# Altium project SpaceWallACPowerDistribution.PrjPcb (part 3 of 3)

## Sheet ACPowerDistributionFanControl.SchDoc
size B; SheetNumber: 5; SheetTotal: 5
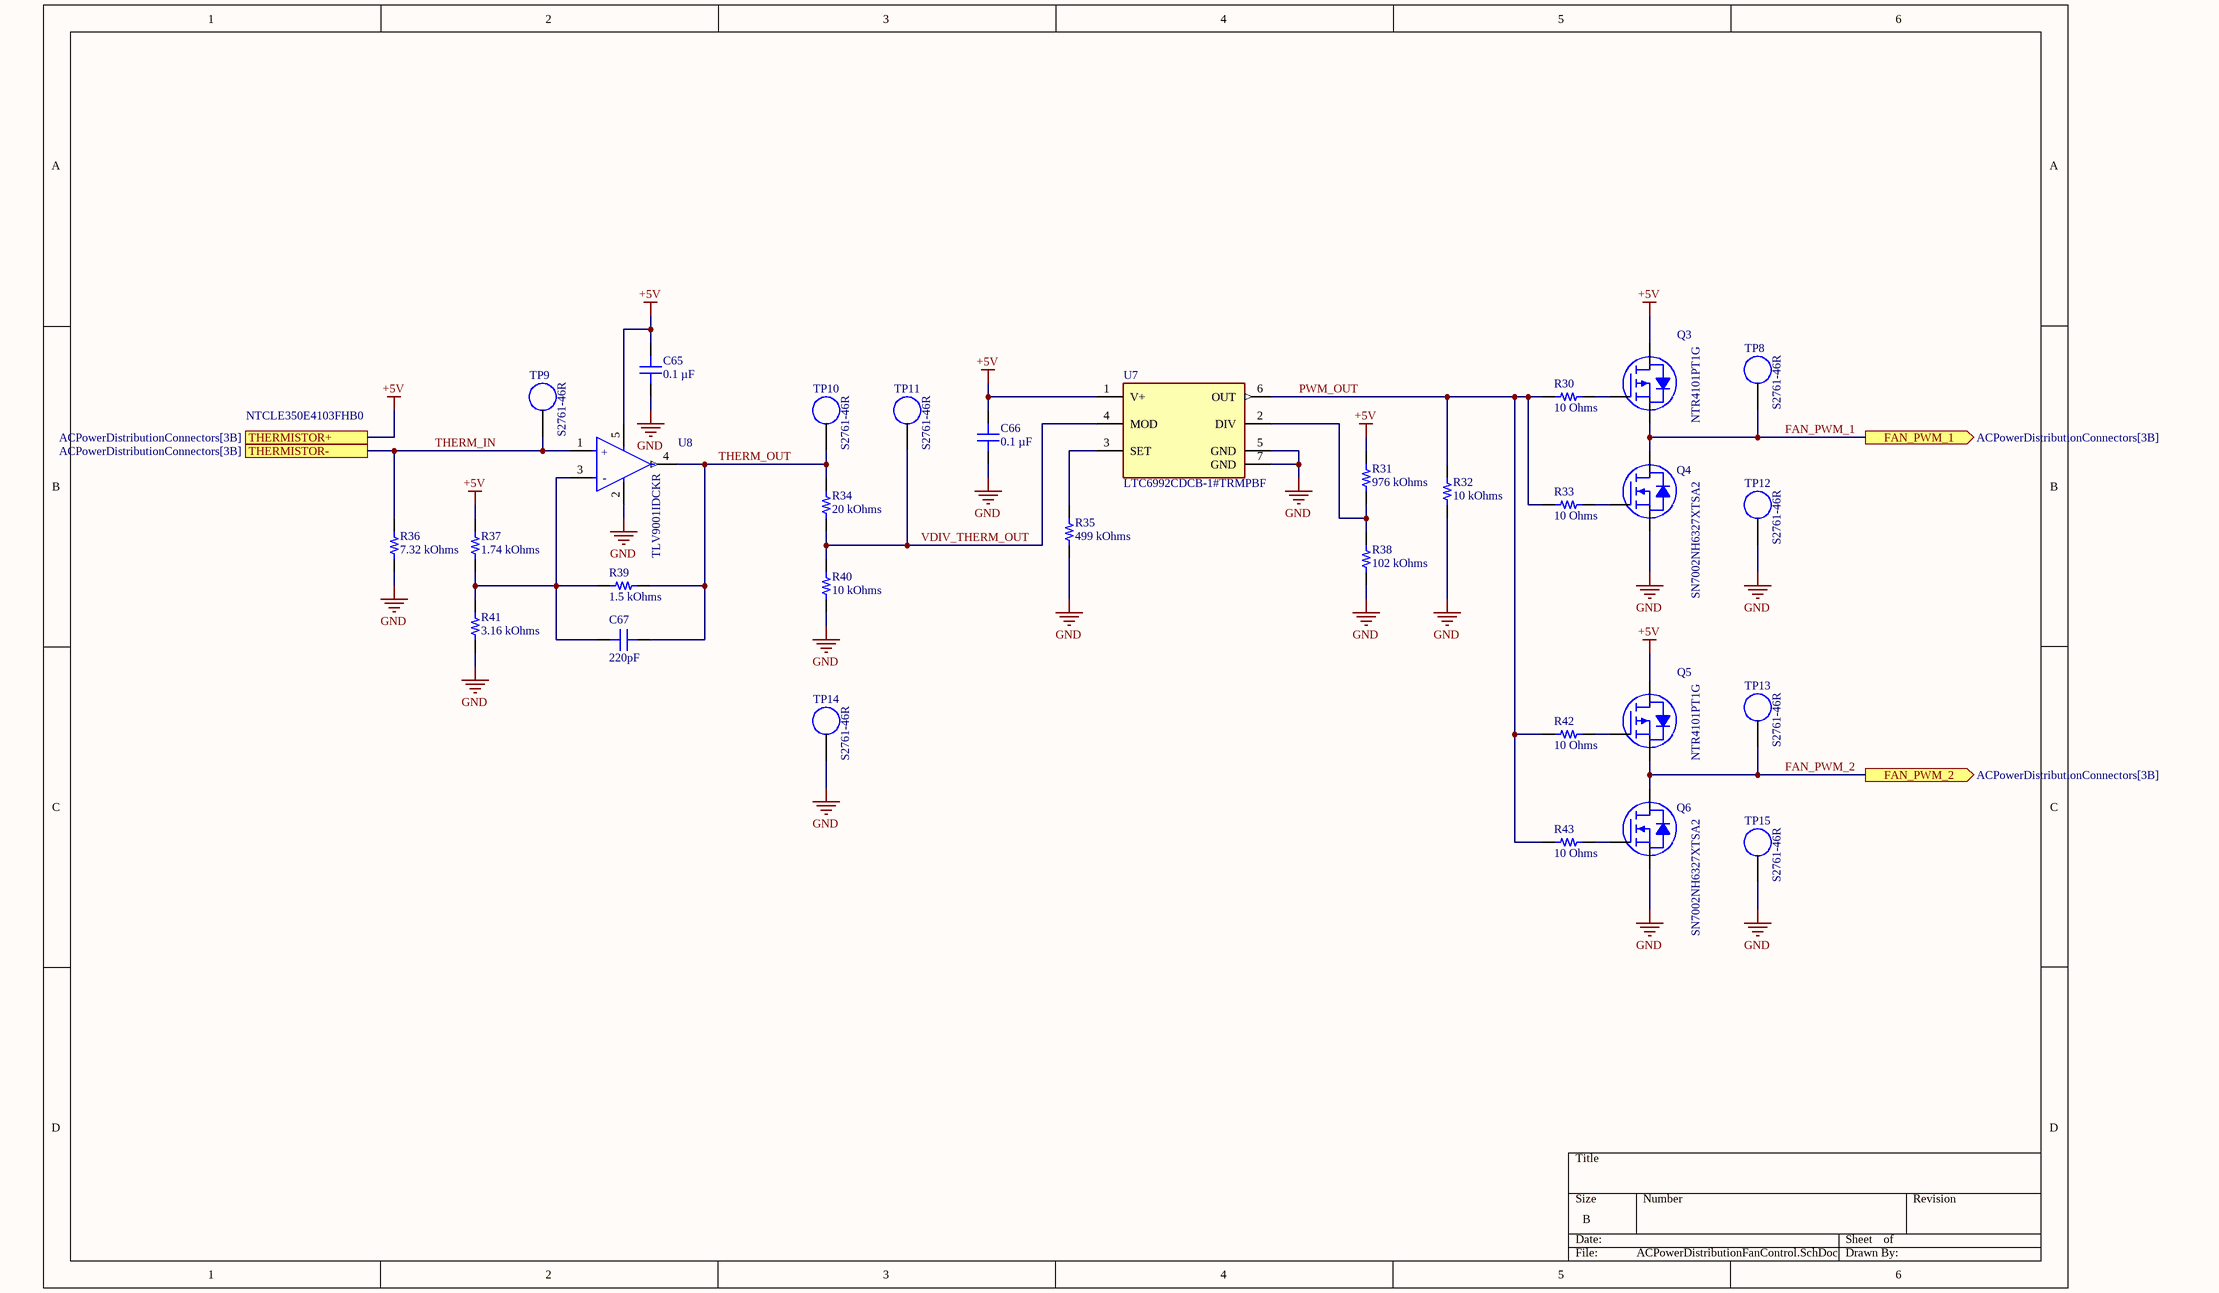
[diagram p4: ACPowerDistributionFanControl.SchDoc]

### Parts
C65  0.1 µF  [CAP 0603_1608]
C66  0.1 µF  [CAP 0603_1608]
C67  220pF  [CAP 0603_1608]
Q3  NTR4101PT1G  [ON SEMI SOT-23-3]
Q4  SN7002NH6327XTSA2  [INFINEON SOT-23-3]
Q5  NTR4101PT1G  [ON SEMI SOT-23-3]
Q6  SN7002NH6327XTSA2  [INFINEON SOT-23-3]
R30  10 Ohms  [RES 0603_1608]
R31  976 kOhms  [RES 0603_1608]
R32  10 kOhms  [RES 0603_1608]
R33  10 Ohms  [RES 0603_1608]
R34  20 kOhms  [RES 0603_1608]
R35  499 kOhms  [RES 0603_1608]
R36  7.32 kOhms  [RES 0603_1608]
R37  1.74 kOhms  [RES 0603_1608]
R38  102 kOhms  [RES 0603_1608]
R39  1.5 kOhms  [RES 0603_1608]
R40  10 kOhms  [RES 0603_1608]
R41  3.16 kOhms  [RES 0603_1608]
R42  10 Ohms  [RES 0603_1608]
R43  10 Ohms  [RES 0603_1608]
TP8  S2761-46R  [S2761-46R]
TP9  S2761-46R  [S2761-46R]
TP10  S2761-46R  [S2761-46R]
TP11  S2761-46R  [S2761-46R]
TP12  S2761-46R  [S2761-46R]
TP13  S2761-46R  [S2761-46R]
TP14  S2761-46R  [S2761-46R]
TP15  S2761-46R  [S2761-46R]
U7  LTC6992CDCB-1#TRMPBF  [FP-DCB-6-05-08-1715-MFG]
U8  TLV9001IDCKR  [FP-DCK0005A-MFG]

### Ports
FAN_PWM_1 (out, see ACPowerDistributionConnectors[3B]), FAN_PWM_2 (out, see ACPowerDistributionConnectors[3B]), THERMISTOR+ (see ACPowerDistributionConnectors[3B]), THERMISTOR- (see ACPowerDistributionConnectors[3B])

### Nets
+5V: C65.2 C66.2 Q3.3(D) Q5.3(D) R31.2 R37.2 U7.1(V+) U8.5(V+) ; port THERMISTOR+
GND: C65.1 C66.1 Q4.2(S) Q6.2(S) R32.1 R35.1 R36.1 R38.1 R40.1 R41.1 TP12.1 TP14.1 TP15.1 U7.5(GND) U7.7(GND) U8.2(V-)
FAN_PWM_1: Q3.2(S) Q4.3(D) TP8.1 ; port FAN_PWM_1
FAN_PWM_2: Q5.2(S) Q6.3(D) TP13.1 ; port FAN_PWM_2
PWM_OUT: R30.1 R32.2 R33.1 R42.1 R43.1 U7.6(OUT)
THERM_IN: R36.2 TP9.1 U8.1(IN+) ; port THERMISTOR-
THERM_OUT: C67.2 R34.2 R39.2 TP10.1 U8.4(OUT)
VDIV_THERM_OUT: R34.1 R40.2 TP11.1 U7.4(MOD)
NetC67_1: C67.1 R37.1 R39.1 R41.2 U8.3(IN-)
NetQ3_1: Q3.1(G) R30.2
NetQ4_1: Q4.1(G) R33.2
NetQ5_1: Q5.1(G) R42.2
NetQ6_1: Q6.1(G) R43.2
NetR31_1: R31.1 R38.2 U7.2(DIV)
NetR35_2: R35.2 U7.3(SET)

### Notes on the sheet
- NTCLE350E4103FHB0
- (in symbol CMP-04895-000186-1) +; -

### Library data of the parts
C65 C66 = CL10B104KA8WPNC: CAP CER 0.1UF 25V X7R 0603; manufacturer: Samsung Electro-Mechanics; Tolerance: ±10%; Part Number: CL10B104KA8WPNC; Capacitance: 0.1 µF; Applications: Automotive; componentlink1description: Datasheet; componentlink1url: http://www.samsungsem.com/kr/support/product-search/mlcc/CL10B104KA8WPNC.jsp; componentlink2description: DigiKey Link; componentlink2url: https://www.digikey.com/en/products/detail/samsung-electro-mechanics/CL10B104KA8WPNC/5961201; Device Package: 0603 (1608 Metric); Features: Open Mode; lastupdated: 2/9/2024 8:10:26 PM; Lifecycle Status: Active; Minimum Order: 1; Mounting Type: Surface Mount, MLCC; Operating Temperature: -55°C ~ 125°C; Package / Case: 0603 (1608 Metric); packaging: TapeAndReel; partid: 5631; Part Status: Active; price: 0.01; Ratings: AEC-Q200; series: CL; Size / Dimension: 0.063" L x 0.031" W (1.60mm x 0.80mm); Supplier 1: DigiKey; Supplier Part Number 1: 1276-6717-1-ND; Temperature Coefficient: X7R; Thickness (Max): 0.035" (0.90mm); value: 0.1 µF; Voltage - Rated: 25V
C67 = 06033A221KAT2A: CAP CER 220PF 25V C0G/NP0 0603; manufacturer: AVX Corporation; Temperature Coefficient: C0G, NP0; Tolerance: ±10%; Part Number: 06033A221KAT2A; Capacitance: 220pF; Applications: General Purpose; componentlink1description: Datasheet; componentlink1url: http://datasheets.avx.com/C0GNP0-Dielectric.pdf; componentlink2description: DigiKey Link; componentlink2url: http://digikey.com/product-detail/en/avx-corporation/06033A221KAT2A/478-06033A221KAT2ACT-ND/11570165; Device Package: 0603 (1608 Metric); lastupdated: 9/2/2020 1:02:55 AM; Lifecycle Status: Active; Minimum Order: 1; Mounting Type: Surface Mount, MLCC; Operating Temperature: -55°C ~ 125°C; Package / Case: 0603 (1608 Metric); packaging: TapeAndReel; partid: 27402; Part Status: Active; price: 0.04; series: -; Supplier 1: DigiKey; Supplier Part Number 1: 478-06033A221KAT2ACT-ND; value: 220pF; Voltage - Rated: 25V
Q3 Q5 = NTR4101PT1G: MOSFET P-CH 20V 1.8A SOT-23; Manufacturer: ON Semiconductor; Current - Continuous Drain (Id) @ 25°C: 1.8A (Ta); Drive Voltage (Max Rds On,  Min Rds On): 1.8V, 4.5V; FET Type: P-Channel; Gate Charge (Qg) (Max) @ Vgs: 8.5nC @ 4.5V; Input Capacitance (Ciss) (Max) @ Vds: 675pF @ 10V; Power Dissipation (Max): 420mW (Ta); Rds On (Max) @ Id, Vgs: 85mOhm @ 1.6A, 4.5V; Vgs (Max): ±8V; Vgs(th) (Max) @ Id: 1.2V @ 250µA; Part Number: NTR4101PT1G; ComponentLink1Description: Datasheet; ComponentLink1URL: http://www.onsemi.com/pub/Collateral/NTR4101P-D.PDF; ComponentLink2Description: DigiKey Link; ComponentLink2URL: http://digikey.com/product-detail/en/on-semiconductor/NTR4101PT1G/NTR4101PT1GOSCT-ND/687132; Drain to Source Voltage (Vdss): 20V; LastUpdated: 6/3/2024 8:15:27 PM; Lifecycle Status: Active; Minimum Order: 1; Mounting Type: Surface Mount; Operating Temperature: -55°C ~ 150°C (TJ); Package / Case: TO-236-3, SC-59, SOT-23-3; Packaging: TapeAndReel; Part Status: Active; Price: 0.07; Series: -; Supplier 1: DigiKey; Supplier Part Number 1: NTR4101PT1GOSCT-ND; Supplier Device Package: SOT-23-3 (TO-236); Technology: MOSFET (Metal Oxide)
Q4 Q6 = SN7002NH6327XTSA2: MOSFET N-CH 60V 200MA SOT23-3; Manufacturer: Infineon Technologies; Current - Continuous Drain (Id) @ 25°C: 200mA (Ta); Drive Voltage (Max Rds On,  Min Rds On): 4.5V, 10V; FET Type: N-Channel; Gate Charge (Qg) (Max) @ Vgs: 1.5 nC @ 10 V; Input Capacitance (Ciss) (Max) @ Vds: 45 pF @ 25 V; Power Dissipation (Max): 360mW (Ta); Rds On (Max) @ Id, Vgs: 5Ohm @ 500mA, 10V; Vgs (Max): ±20V; Vgs(th) (Max) @ Id: 1.8V @ 26µA; Part Number: SN7002NH6327XTSA2; ComponentLink1Description: Datasheet; ComponentLink1URL: https://www.infineon.com/dgdl/SN7002N_Rev2.6_.pdf?folderId=db3a3043156fd573011622e10b5c1f67&fileId=db3a304330f6860601311934e76045d5; ComponentLink2Description: DigiKey Link; ComponentLink2URL: https://www.digikey.com/en/products/detail/infineon-technologies/SN7002NH6327XTSA2/6164410; Drain to Source Voltage (Vdss): 60 V; LastUpdated: 6/3/2024 8:15:23 PM; Lifecycle Status: Active; Minimum Order: 1; Mounting Type: Surface Mount; Operating Temperature: -55°C ~ 150°C (TJ); Package / Case: TO-236-3, SC-59, SOT-23-3; Packaging: TapeAndReel; Part Status: Active; Price: 0.04; Series: SIPMOS®; Supplier 1: DigiKey; Supplier Part Number 1: SN7002NH6327XTSA2CT-ND; Supplier Device Package: PG-SOT23; Technology: MOSFET (Metal Oxide)
R30 R33 R42 R43 = RMCF0603FT10R0: RES 10 OHM 1% 1/10W 0603; Manufacturer: Stackpole Electronics Inc; Power (Watts): 0.1W, 1/10W; Temperature Coefficient: ±100ppm/°C; Part Number: RMCF0603FT10R0; Value: 10 Ohms; ComponentLink1Description: Datasheet; ComponentLink1URL: https://www.seielect.com/catalog/sei-rmcf_rmcp.pdf; ComponentLink2Description: DigiKey Link; ComponentLink2URL: https://www.digikey.com/en/products/detail/stackpole-electronics-inc/RMCF0603FT10R0/1761152; Composition: Thick Film; Device Package: 0603 (1608 Metric); Features: Automotive AEC-Q200; Height - Seated (Max): 0.022" (0.55mm); LastUpdated: 2/9/2024 8:43:32 PM; Lifecycle Status: Active; Minimum Order: 1; Number of Terminations: 2; Operating Temperature: -55°C ~ 155°C; Package / Case: 0603 (1608 Metric); Packaging: CutTape; PartId: 6083; Part Status: Active; Price: 0.01; Ratings: AEC-Q200; Resistance: 10 Ohms; Series: RMCF; Size / Dimension: 0.061" L x 0.031" W (1.55mm x 0.80mm); Supplier 1: DigiKey; Supplier Part Number 1: RMCF0603FT10R0CT-ND; Supplier Device Package: 0603; Tolerance: ±1%
R31 = RMCF0603FT976K: RES 976K OHM 1% 1/10W 0603; Manufacturer: Stackpole Electronics Inc; Power (Watts): 0.1W, 1/10W; Temperature Coefficient: ±100ppm/°C; Part Number: RMCF0603FT976K; Value: 976 kOhms; ComponentLink1Description: Datasheet; ComponentLink1URL: https://www.seielect.com/catalog/sei-rmcf_rmcp.pdf; ComponentLink2Description: DigiKey Link; ComponentLink2URL: https://www.digikey.com/en/products/detail/stackpole-electronics-inc/RMCF0603FT976K/1714309; Composition: Thick Film; Device Package: 0603 (1608 Metric); Features: Automotive AEC-Q200; Height - Seated (Max): 0.022" (0.55mm); LastUpdated: 2/9/2024 8:42:17 PM; Lifecycle Status: Active; Minimum Order: 1; Number of Terminations: 2; Operating Temperature: -55°C ~ 155°C; Package / Case: 0603 (1608 Metric); Packaging: CutTape; PartId: 23785; Part Status: Active; Price: 0.01; Ratings: AEC-Q200; Resistance: 976 kOhms; Series: RMCF; Size / Dimension: 0.061" L x 0.031" W (1.55mm x 0.80mm); Supplier 1: DigiKey; Supplier Part Number 1: RMCF0603FT976KCT-ND; Supplier Device Package: 0603; Tolerance: ±1%
R32 = RMCF0603FT10K0: RES 10K OHM 1% 1/10W 0603; Manufacturer: Stackpole Electronics Inc; Power (Watts): 0.1W, 1/10W; Temperature Coefficient: ±100ppm/°C; Part Number: RMCF0603FT10K0; Value: 10 kOhms; ComponentLink1Description: Datasheet; ComponentLink1URL: https://www.seielect.com/catalog/sei-rmcf_rmcp.pdf; ComponentLink2Description: DigiKey Link; ComponentLink2URL: https://www.digikey.com/en/products/detail/stackpole-electronics-inc/RMCF0603FT10K0/1761235; Composition: Thick Film; Device Package: 0603 (1608 Metric); Features: Automotive AEC-Q200; Height - Seated (Max): 0.022" (0.55mm); LastUpdated: 2/9/2024 8:42:00 PM; Lifecycle Status: Active; Minimum Order: 1; Number of Terminations: 2; Operating Temperature: -55°C ~ 155°C; Package / Case: 0603 (1608 Metric); Packaging: CutTape; PartId: 25663; Part Status: Active; Price: 0.01; Ratings: AEC-Q200; Resistance: 10 kOhms; Series: RMCF; Size / Dimension: 0.061" L x 0.031" W (1.55mm x 0.80mm); Supplier 1: DigiKey; Supplier Part Number 1: RMCF0603FT10K0CT-ND; Supplier Device Package: 0603; Tolerance: ±1%
R34 = RNCF0603BTC20K0: RES SMD 20K OHM 0.1% 1/6W 0603; Manufacturer: Stackpole Electronics Inc; Power (Watts): 0.167W, 1/6W; Temperature Coefficient: ±50ppm/°C; Part Number: RNCF0603BTC20K0; Value: 20 kOhms; ComponentLink1Description: Datasheet; ComponentLink1URL: https://www.seielect.com/catalog/sei-rncf.pdf; ComponentLink2Description: DigiKey Link; ComponentLink2URL: https://www.digikey.com/en/products/detail/stackpole-electronics-inc/RNCF0603BTC20K0/2027033; Composition: Thin Film; Device Package: 0603 (1608 Metric); Features: Automotive AEC-Q200; Height - Seated (Max): 0.022" (0.55mm); LastUpdated: 2/9/2024 8:43:19 PM; Lifecycle Status: Active; Minimum Order: 1; Number of Terminations: 2; Operating Temperature: -55°C ~ 155°C; Package / Case: 0603 (1608 Metric); Packaging: TapeAndReel; PartId: 9262; Part Status: Active; Price: 0.04; Ratings: AEC-Q200; Resistance: 20 kOhms; Series: RNCF; Size / Dimension: 0.061" L x 0.031" W (1.55mm x 0.80mm); Supplier 1: DigiKey; Supplier Part Number 1: RNCF0603BTC20K0CT-ND; Supplier Device Package: 0603; Tolerance: ±0.1%
R35 = RMCF0603FT499K: RES 499K OHM 1% 1/10W 0603; Manufacturer: Stackpole Electronics Inc; Power (Watts): 0.1W, 1/10W; Temperature Coefficient: ±100ppm/°C; Part Number: RMCF0603FT499K; Value: 499 kOhms; ComponentLink1Description: Datasheet; ComponentLink1URL: https://www.seielect.com/catalog/sei-rmcf_rmcp.pdf; ComponentLink2Description: DigiKey Link; ComponentLink2URL: https://www.digikey.com/en/products/detail/stackpole-electronics-inc/RMCF0603FT499K/1760910; Composition: Thick Film; Device Package: 0603 (1608 Metric); Features: Automotive AEC-Q200; Height - Seated (Max): 0.022" (0.55mm); LastUpdated: 2/9/2024 8:43:14 PM; Lifecycle Status: Active; Minimum Order: 1; Number of Terminations: 2; Operating Temperature: -55°C ~ 155°C; Package / Case: 0603 (1608 Metric); Packaging: CutTape; PartId: 10650; Part Status: Active; Price: 0.01; Ratings: AEC-Q200; Resistance: 499 kOhms; Series: RMCF; Size / Dimension: 0.061" L x 0.031" W (1.55mm x 0.80mm); Supplier 1: DigiKey; Supplier Part Number 1: RMCF0603FT499KCT-ND; Supplier Device Package: 0603; Tolerance: ±1%
R36 = ERA-3AEB7321V: RES SMD 7.32KOHM 0.1% 1/10W 0603; Manufacturer: Panasonic Electronic Components; Power (Watts): 0.1W, 1/10W; Temperature Coefficient: ±25ppm/°C; Part Number: ERA-3AEB7321V; Value: 7.32 kOhms; ComponentLink1Description: Datasheet; ComponentLink1URL: https://industrial.panasonic.com/cdbs/www-data/pdf/RDM0000/AOA0000C307.pdf; ComponentLink2Description: DigiKey Link; ComponentLink2URL: https://www.digikey.com/en/products/detail/panasonic-electronic-components/ERA-3AEB7321V/2026827; Composition: Thin Film; Device Package: 0603 (1608 Metric); Features: Automotive AEC-Q200; Height - Seated (Max): 0.022" (0.55mm); LastUpdated: 2/9/2024 8:42:26 PM; Lifecycle Status: Active; Minimum Order: 1; Number of Terminations: 2; Operating Temperature: -55°C ~ 155°C; Package / Case: 0603 (1608 Metric); Packaging: TapeAndReel; PartId: 22666; Part Status: Active; Price: 0.03; Ratings: AEC-Q200; Resistance: 7.32 kOhms; Series: ERA-3A; Size / Dimension: 0.063" L x 0.031" W (1.60mm x 0.80mm); Supplier 1: DigiKey; Supplier Part Number 1: P7.32KDBCT-ND; Supplier Device Package: 0603; Tolerance: ±0.1%
R37 = ERA-3AEB1741V: RES SMD 1.74KOHM 0.1% 1/10W 0603; Manufacturer: Panasonic Electronic Components; Power (Watts): 0.1W, 1/10W; Temperature Coefficient: ±25ppm/°C; Part Number: ERA-3AEB1741V; Value: 1.74 kOhms; ComponentLink1Description: Datasheet; ComponentLink1URL: https://industrial.panasonic.com/cdbs/www-data/pdf/RDM0000/AOA0000C307.pdf; ComponentLink2Description: DigiKey Link; ComponentLink2URL: https://www.digikey.com/en/products/detail/panasonic-electronic-components/ERA-3AEB1741V/2026768; Composition: Thin Film; Device Package: 0603 (1608 Metric); Features: Automotive AEC-Q200; Height - Seated (Max): 0.022" (0.55mm); LastUpdated: 2/9/2024 8:42:09 PM; Lifecycle Status: Active; Minimum Order: 1; Number of Terminations: 2; Operating Temperature: -55°C ~ 155°C; Package / Case: 0603 (1608 Metric); Packaging: TapeAndReel; PartId: 24753; Part Status: Active; Price: 0.03; Ratings: AEC-Q200; Resistance: 1.74 kOhms; Series: ERA-3A; Size / Dimension: 0.063" L x 0.031" W (1.60mm x 0.80mm); Supplier 1: DigiKey; Supplier Part Number 1: P1.74KDBCT-ND; Supplier Device Package: 0603; Tolerance: ±0.1%
R38 = RMCF0603FG102K: RES 102K OHM 1% 1/10W 0603; Manufacturer: Stackpole Electronics Inc; Power (Watts): 0.1W, 1/10W; Temperature Coefficient: ±100ppm/°C; Part Number: RMCF0603FG102K; Value: 102 kOhms; ComponentLink1Description: Datasheet; ComponentLink1URL: https://www.seielect.com/catalog/sei-packaging.pdf; ComponentLink2Description: DigiKey Link; ComponentLink2URL: https://www.digikey.com/en/products/detail/stackpole-electronics-inc/RMCF0603FG102K/1713546; Composition: Thick Film; Device Package: 0603 (1608 Metric); Features: Automotive AEC-Q200; Height - Seated (Max): 0.022" (0.55mm); LastUpdated: 2/9/2024 8:43:28 PM; Lifecycle Status: Active; Minimum Order: 1; Number of Terminations: 2; Operating Temperature: -55°C ~ 155°C; Package / Case: 0603 (1608 Metric); Packaging: CutTape; PartId: 6978; Part Status: Active; Price: 0.01; Ratings: AEC-Q200; Resistance: 102 kOhms; Series: RMCF; Size / Dimension: 0.061" L x 0.031" W (1.55mm x 0.80mm); Supplier 1: DigiKey; Supplier Part Number 1: 738-RMCF0603FG102KCT-ND; Supplier Device Package: 0603; Tolerance: ±1%
R39 = RNCS0603BKE1K50: RES 1.5K OHM 0.1% 1/16W 0603; Manufacturer: Stackpole Electronics Inc; Power (Watts): 0.063W, 1/16W; Temperature Coefficient: ±25ppm/°C; Part Number: RNCS0603BKE1K50; Value: 1.5 kOhms; ComponentLink1Description: Datasheet; ComponentLink1URL: https://www.seielect.com/catalog/sei-rncs_rnch.pdf; ComponentLink2Description: DigiKey Link; ComponentLink2URL: https://www.digikey.com/en/products/detail/stackpole-electronics-inc/RNCS0603BKE1K50/1799986; Composition: Thin Film; Device Package: 0603 (1608 Metric); Features: Anti-Corrosive, Automotive AEC-Q200, Moisture Resistant; Height - Seated (Max): 0.022" (0.55mm); LastUpdated: 2/9/2024 8:42:04 PM; Lifecycle Status: Active; Minimum Order: 1; Number of Terminations: 2; Operating Temperature: -55°C ~ 155°C; Package / Case: 0603 (1608 Metric); Packaging: TapeAndReel; PartId: 25286; Part Status: Active; Price: 0.06; Ratings: AEC-Q200; Resistance: 1.5 kOhms; Series: RNCS; Size / Dimension: 0.061" L x 0.031" W (1.55mm x 0.80mm); Supplier 1: DigiKey; Supplier Part Number 1: RNCS0603BKE1K50CT-ND; Supplier Device Package: 0603; Tolerance: ±0.1%
R40 = RNCF0603BTE10K0: RES SMD 10K OHM 0.1% 1/6W 0603; Manufacturer: Stackpole Electronics Inc; Power (Watts): 0.167W, 1/6W; Temperature Coefficient: ±25ppm/°C; Part Number: RNCF0603BTE10K0; Value: 10 kOhms; ComponentLink1Description: Datasheet; ComponentLink1URL: https://www.seielect.com/catalog/sei-rncf.pdf; ComponentLink2Description: DigiKey Link; ComponentLink2URL: https://www.digikey.com/en/products/detail/stackpole-electronics-inc/RNCF0603BTE10K0/1710011; Composition: Thin Film; Device Package: 0603 (1608 Metric); Features: Automotive AEC-Q200; Height - Seated (Max): 0.022" (0.55mm); LastUpdated: 2/9/2024 8:43:16 PM; Lifecycle Status: Active; Minimum Order: 1; Number of Terminations: 2; Operating Temperature: -55°C ~ 155°C; Package / Case: 0603 (1608 Metric); Packaging: TapeAndReel; PartId: 10152; Part Status: Active; Price: 0.04; Ratings: AEC-Q200; Resistance: 10 kOhms; Series: RNCF; Size / Dimension: 0.061" L x 0.031" W (1.55mm x 0.80mm); Supplier 1: DigiKey; Supplier Part Number 1: RNCF0603BTE10K0CT-ND; Supplier Device Package: 0603; Tolerance: ±0.1%
R41 = ERA-3AEB3161V: RES SMD 3.16KOHM 0.1% 1/10W 0603; Manufacturer: Panasonic Electronic Components; Power (Watts): 0.1W, 1/10W; Temperature Coefficient: ±25ppm/°C; Part Number: ERA-3AEB3161V; Value: 3.16 kOhms; ComponentLink1Description: Datasheet; ComponentLink1URL: https://industrial.panasonic.com/cdbs/www-data/pdf/RDM0000/AOA0000C307.pdf; ComponentLink2Description: DigiKey Link; ComponentLink2URL: https://www.digikey.com/en/products/detail/panasonic-electronic-components/ERA-3AEB3161V/2026792; Composition: Thin Film; Device Package: 0603 (1608 Metric); Features: Automotive AEC-Q200; Height - Seated (Max): 0.022" (0.55mm); LastUpdated: 2/9/2024 8:42:09 PM; Lifecycle Status: Active; Minimum Order: 1; Number of Terminations: 2; Operating Temperature: -55°C ~ 155°C; Package / Case: 0603 (1608 Metric); Packaging: TapeAndReel; PartId: 24685; Part Status: Active; Price: 0.03; Ratings: AEC-Q200; Resistance: 3.16 kOhms; Series: ERA-3A; Size / Dimension: 0.063" L x 0.031" W (1.60mm x 0.80mm); Supplier 1: DigiKey; Supplier Part Number 1: P3.16KDBCT-ND; Supplier Device Package: 0603; Tolerance: ±0.1%
U7 = CMP-09079-000050-1: IC OSC SILICON PROG 6-DFN; Max Supply Voltage: 5.5V; Frequency: 3.81Hz; Number of Timers/Counters: 1; Frequency Tolerance: 2.4%; Operating Supply Current: 365uA; Min Supply Voltage: 2.25V; Width: 2mm; Height: 0.75mm; Depth: 3mm; Packaging: Cut Tape; Min Operating Temperature: 0°C; Case/Package: DFN; Length: 2mm; Max Operating Temperature: 70°C; RoHS Compliant: Yes; Series: TimerBlox®; Number of Pins: 6; Package Quantity: 1; Mount: Surface Mount; Reach SVHC Compliant: Yes
U8 = CMP-04895-000186-1: IC CMOS 1 CIRCUIT SC70-5; Number of Channels: 1; Input Bias Current: 5pA; Operating Supply Current: 60uA; Gain Bandwidth Product: 1MHz; Slew Rate: 2V/µs; Input Offset Voltage (Vos): 400uV; Output Current per Channel: 40mA; Max Operating Temperature: 125°C; Min Operating Temperature: -40°C; Mount: Surface Mount; RoHS Compliant: Yes; Packaging: Tape and Reel; Number of Circuits: 1
TP8-TP15 = S2761-46R: Supplier 1: DigiKey; Supplier Part Number 1: 952-2665-1-ND

## Nets that join several sheets
+5V: ACPowerDistributionConnectors (J6.1), ACPowerDistributionDCtoDC (8 pins), ACPowerDistributionFanControl (8 pins)
+12V_FAN: ACPowerDistributionConnectors (C1.2 C2.2 J4.1 J5.1), ACPowerDistributionACtoDC (5 pins), ACPowerDistributionDCtoDC (C10.2 C11.2 U3.2 U3.3)
+12V_USB: ACPowerDistributionACtoDC (5 pins), ACPowerDistributionUSB-PD (17 pins)
GND: ACPowerDistributionConnectors (16 pins), ACPowerDistributionACtoDC (9 pins), ACPowerDistributionDCtoDC (12 pins), ACPowerDistributionUSB-PD (44 pins), ACPowerDistributionFanControl (16 pins)
USB_GND: ACPowerDistributionConnectors (10 pins), ACPowerDistributionUSB-PD (18 pins)
V_USB: ACPowerDistributionConnectors (6 pins), ACPowerDistributionUSB-PD (26 pins)
AC_L: ACPowerDistributionConnectors (7 pins), ACPowerDistributionACtoDC (U1.2 U2.2)
AC_N: ACPowerDistributionConnectors (8 pins), ACPowerDistributionACtoDC (U1.1 U2.1)
FAN_PWM_1: ACPowerDistributionConnectors (J4.4), ACPowerDistributionFanControl (Q3.2 Q4.3 TP8.1)
FAN_PWM_2: ACPowerDistributionConnectors (J5.4), ACPowerDistributionFanControl (Q5.2 Q6.3 TP13.1)
THERM_IN: ACPowerDistributionConnectors (J6.2), ACPowerDistributionFanControl (R36.2 TP9.1 U8.1)
USB_CC1: ACPowerDistributionConnectors (J7.A5), ACPowerDistributionUSB-PD (R23.2 U6.2 U6.9)
USB_CC2: ACPowerDistributionConnectors (J7.B5), ACPowerDistributionUSB-PD (R24.2 U6.1 U6.10)
USB_DM: ACPowerDistributionConnectors (J7.A7 J7.B7), ACPowerDistributionUSB-PD (C62.2 U5.17 U6.5 U6.6)
USB_DP: ACPowerDistributionConnectors (J7.A6 J7.B6), ACPowerDistributionUSB-PD (C61.2 U5.16 U6.4 U6.7)